# Altium schematic sheet Analog to Digital Con.SchDoc
size A
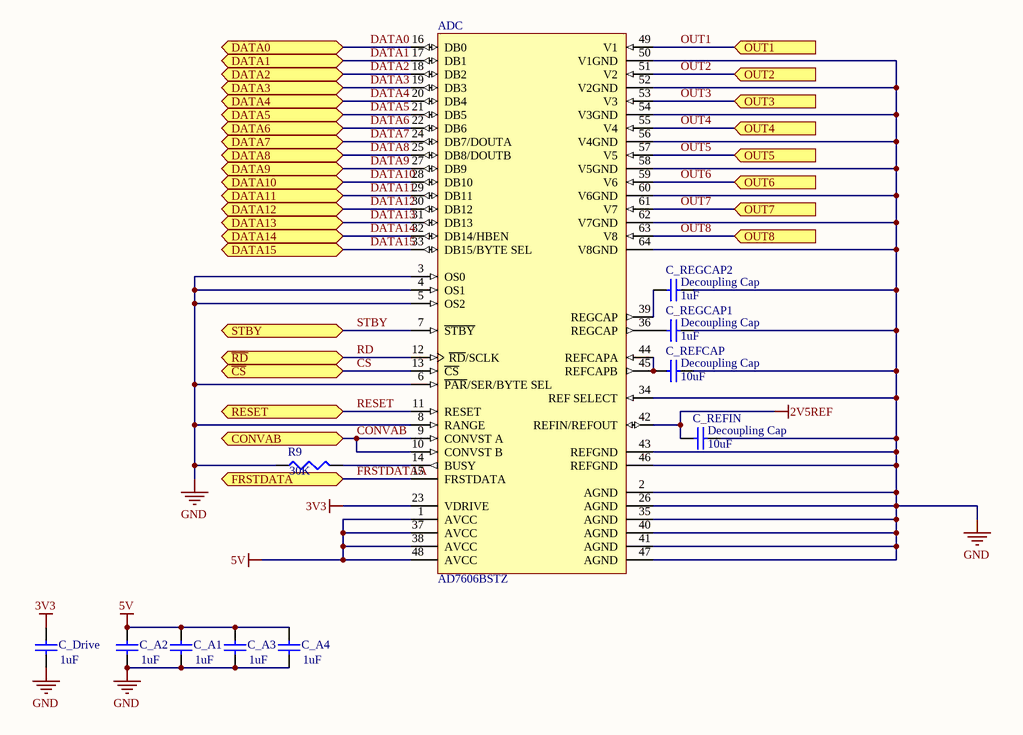
[diagram p0: Analog to Digital Con.SchDoc]

## Parts
ADC  AD7606BSTZ  [ST-64-2_N]
C_A1  value 1uF  [6-0805_N]  (hidden comment: Decoupling Cap)
C_A2  value 1uF  [6-0805_N]  (hidden comment: Decoupling Cap)
C_A3  value 1uF  [6-0805_N]  (hidden comment: Decoupling Cap)
C_A4  value 1uF  [6-0805_N]  (hidden comment: Decoupling Cap)
C_Drive  value 1uF  [6-0805_N]  (hidden comment: Decoupling Cap)
C_REFCAP  Decoupling Cap  value 10uF  [6-0805_N]
C_REFIN  Decoupling Cap  value 10uF  [6-0805_N]
C_REGCAP1  Decoupling Cap  value 1uF  [6-0805_N]
C_REGCAP2  Decoupling Cap  value 1uF  [6-0805_N]
R9  value 30K  [6-0805_N]  (hidden comment: Res3)

## Ports
CONVAB, DATA0, DATA1, DATA2, DATA3, DATA4, DATA5, DATA6, DATA7, DATA8, DATA9, DATA10, DATA11, DATA12, DATA13, DATA14, DATA15, FRSTDATA, OUT1 (in), OUT2 (in), OUT3 (in), OUT4 (in), OUT5 (in), OUT6 (in), OUT7 (in), OUT8 (in), RESET, STBY, ~{CS}, ~{RD}

## Nets
2V5REF: ADC.42(REFIN/REFOUT) C_REFIN.2
3V3: ADC.23(VDRIVE) C_Drive.1
5V: ADC.1(AVCC) ADC.37(AVCC) ADC.38(AVCC) ADC.48(AVCC) C_A1.1 C_A2.1 C_A3.1 C_A4.1
GND: ADC.2(AGND) ADC.3(OS0) ADC.4(OS1) ADC.5(OS2) ADC.6(~{PAR}/SER/BYTE_SEL) ADC.8(RANGE) ADC.26(AGND) ADC.34(REF_SELECT) ADC.35(AGND) ADC.40(AGND) ADC.41(AGND) ADC.43(REFGND) ADC.46(REFGND) ADC.47(AGND) ADC.50(V1GND) ADC.52(V2GND) ADC.54(V3GND) ADC.56(V4GND) ADC.58(V5GND) ADC.60(V6GND) ADC.62(V7GND) ADC.64(V8GND) C_A1.2 C_A2.2 C_A3.2 C_A4.2 C_Drive.2 C_REFCAP.1 C_REFIN.1 C_REGCAP1.1 C_REGCAP2.1 R9.1
CONVAB: ADC.9(CONVST_A) ADC.10(CONVST_B) ; port CONVAB
CS: ADC.13(~{CS}) ; port ~{CS}
DATA0: ADC.16(DB0) ; port DATA0
DATA1: ADC.17(DB1) ; port DATA1
DATA2: ADC.18(DB2) ; port DATA2
DATA3: ADC.19(DB3) ; port DATA3
DATA4: ADC.20(DB4) ; port DATA4
DATA5: ADC.21(DB5) ; port DATA5
DATA6: ADC.22(DB6) ; port DATA6
DATA7: ADC.24(DB7/DOUTA) ; port DATA7
DATA8: ADC.25(DB8/DOUTB) ; port DATA8
DATA9: ADC.27(DB9) ; port DATA9
DATA10: ADC.28(DB10) ; port DATA10
DATA11: ADC.29(DB11) ; port DATA11
DATA12: ADC.30(DB12) ; port DATA12
DATA13: ADC.31(DB13) ; port DATA13
DATA14: ADC.32(DB14/HBEN) ; port DATA14
DATA15: ADC.33(DB15/BYTE_SEL) ; port DATA15
FRSTDATAA: ADC.15(FRSTDATA) ; port FRSTDATA
OUT1: ADC.49(V1) ; port OUT1
OUT2: ADC.51(V2) ; port OUT2
OUT3: ADC.53(V3) ; port OUT3
OUT4: ADC.55(V4) ; port OUT4
OUT5: ADC.57(V5) ; port OUT5
OUT6: ADC.59(V6) ; port OUT6
OUT7: ADC.61(V7) ; port OUT7
OUT8: ADC.63(V8) ; port OUT8
RD: ADC.12(~{RD}/SCLK) ; port ~{RD}
RESET: ADC.11(RESET) ; port RESET
STBY: ADC.7(~{STBY}) ; port STBY
NetADC_14: ADC.14(BUSY) R9.2
NetADC_36: ADC.36(REGCAP) C_REGCAP1.2
NetADC_39: ADC.39(REGCAP) C_REGCAP2.2
NetADC_44: ADC.44(REFCAPA) ADC.45(REFCAPB) C_REFCAP.2

## Library data of the parts
ADC = AD7606BSTZ: 8 Channel Data Acquisition System with 16-Bit, Bipolar Input, Simultaneous Sampling Analog-to-Digital Converter with Parallel, Serial and SPI Interface, 200KSPS, -40 to +85 degC, ST-64-2, Pb-Free, Tray; Generic Part Number: AD7606; Manufacturer: Analog Devices; Resolution (Bits): 16; Channels: 8; Throughput Rate (SPS): 200K; Interface: Par, Ser, SPI; DatasheetVersion: Rev.C; PackageVersion: 051706-A; PackageReference: ST-64-2; PackageDescription: 64-Lead Low Profile Quad Flat Package [LQFP]; Supplier 1: Digi-Key; Supplier Part Number 1: AD7606BSTZ-ND; Supplier 2: Farnell; Supplier Part Number 2: 1864685; Supplier 3: Newark; Supplier Part Number 3: 76R7614; Supplier 4: Mouser; Supplier Part Number 4: 584-AD7606BSTZ; RoHS: Y; Packing: Tray; Mounting Technology: Surface Mount; Code_JEDEC: MS-026-BCD; PartNumber: AD7606BSTZ; ComponentLink1Description: Manufacturer URL; ComponentLink1URL: http://www.analog.com/en/index.html; ComponentLink2Description: Datasheet; ComponentLink2URL: http://www.analog.com/static/imported-files/data_sheets/AD7606_7606-6_7606-4.pdf; ComponentLink3Description: Package Specification; ComponentLink3URL: http://www.analog.com/static/imported-files/packages/PKG_PDF/LQFP%28ST%29/ST_64_2.pdf; ComponentLink4Description: Product URL; ComponentLink4URL: http://www.analog.com/en/analog-to-digital-converters/ad-converters/ad7606/products/product.html
C_A1-C_A4 C_Drive C_REFCAP C_REFIN C_REGCAP1 C_REGCAP2 = Cap Semi: Capacitor (Semiconductor SIM Model); Published: 8-Jun-2000; LatestRevisionDate: 29-May-2009; LatestRevisionNote: IPC-7351 Footprint Added.; PackageReference: C1206; Publisher: Altium Limited; PackageDescription: Chip Capacitor; Supplier 2: Digi-Key
  C_A1-C_A4 C_Drive C_REGCAP1 C_REGCAP2: Supplier Part Number 2: 1276-1066-1-ND
  C_REFCAP C_REFIN: Supplier Part Number 2: 490-3340-1-ND
R9 = Res3: Resistor; Published: 8-Jun-2000; LatestRevisionDate: 29-May-2009; LatestRevisionNote: IPC-7351 Footprint Added.; PackageReference: J1-0603; Publisher: Altium Limited; PackageDescription: Chip Resistor; Supplier 1: Digi-Key; Supplier Part Number 1: 311-30KARCT-ND